# EAGLE design NeoJointV2A-000 (EAGLE 6.6.0)
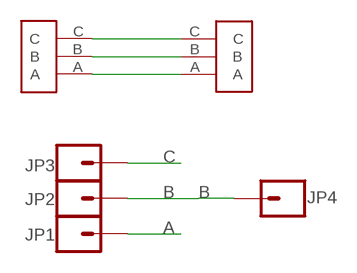
[diagram p0: schematic, sheet 1]

## Parts
JP1  M01PTH  [1X01]
JP2  M01PTH  [1X01]
JP3  M01PTH  [1X01]
JP4  M01PTH  [1X01]
U$1  LED_STRIP_3P  [LEDSTRIP-3P]
U$2  LED_STRIP_3P  [LEDSTRIP-3P]

## Nets
A: JP1.1 U$1.A U$2.A
B: JP2.1 JP4.1 U$1.B U$2.B
C: JP3.1 U$1.C U$2.C

## Library data of the parts
JP1-JP4 = SparkFun-Connectors:M01: Header 1 Standard 1-pin 0.1" header. Use with straight break away headers (SKU : PRT-00116), right angle break away headers (PRT-00553), swiss pins (PRT-00743), machine pins (PRT-00117), and female headers (PRT-00115).
U$1 U$2 = todstuff:LED_STRIP_3P

## Board
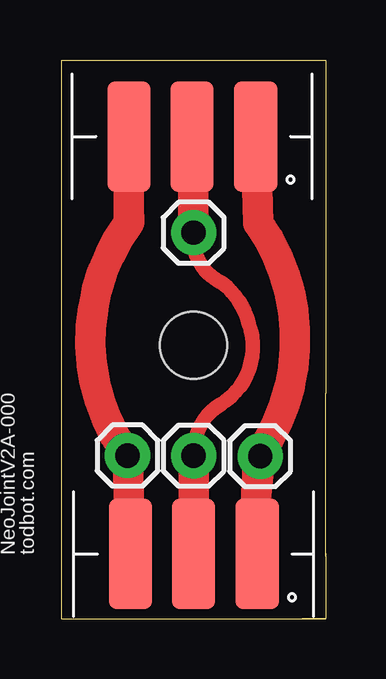
[diagram p1: board, top side]

Size 11 x 23.3 mm. Coordinates in mm from the lower left corner, seen from the top.
Outline: 10.03,0 0,0 0,12.3 0,23.3 11,23.3 11,9.4 11,2.6
Outline: 10.03,0 11,0
Outline: 11,0 10.03,0
Outline: 11,2.7 11,2.6
Outline: 11,2.6 11,0
Copper layers (1*16): Top 0.0356mm / dielectric 1.5011mm / Bottom 0.0356mm
Design rules "LaenPCBOrder-tod": minimum track width 10mil, minimum drill 13mil, track to track 6mil, track to pad 8mil, pad to pad 8mil, via to via 8mil, smd to smd 6mil, copper to edge 15mil, drill to drill 8mil, minimum pad ring 7mil, minimum via ring 7mil, stop-mask expansion 4mil, vias tented up to drill 25mil, thermal gap 10mil
Holes 2.8 mm at 5.5,11.4

### Footprints (pad centres in the part's own frame; a part is rotated, then mirrored left to right if it is on the bottom)
1X01 = drill 1.016 pad 1.88: 1 0,0
LEDSTRIP-3P = smd 4.6 x 1.8: A 0,-2.65; B 0,0; C 0,2.63

### Placement (x,y rotation side)
JP1  8.28,6.78 0 top
JP2  5.5,16.1 0 top
JP3  2.75,6.81 0 top
JP4  5.5,6.8 0 top
U$1  5.5,2.7 90 top
U$2  5.44,20.11 90 top

### Tracks (layer width: path | path; a pad name or v marks a point on that pad's centre or on a via)
A
  Top 1.27: U$2.A 8.2,16.5 arc-70 8.2,6.8 8.1,5.2 | U$1.A 8.1,5.2 | JP1.1 8.1,5.2
B
  Top 0.61: JP4.1 arc-53 6.4,8.8 arc83 7.8,12.3 arc38 6.7,14 arc-73 JP2.1
  Top 1.27: U$1.B JP4.1 | U$2.B JP2.1
C
  Top 1.27: U$1.C JP3.1 arc14 2.6,7 arc-70 2.8,16.5 arc29 2.8,16.8 U$2.C

### Text on the board
tPlace: NeoJointV2A-000 | todbot.com